# EAGLE design gpi-filter3 (EAGLE 7.1.0)
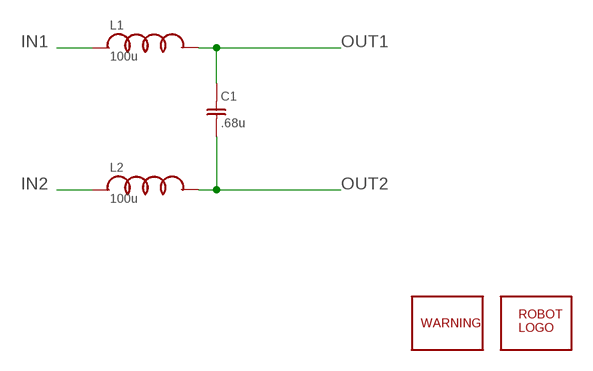
[diagram p0: schematic, sheet 1]

## Parts
C1  .68u  CR46KI36804P1M  [R46KI36804P1M]
L1  100u  LAIRD03  [AIRD03]
L2  100u  LAIRD03  [AIRD03]
U$1  ROBOTMAN-LOGO  [ROBOTMAN-LOGO]
U$2  SYMBOL-WARNING  [SYMBOL-WARNING]

## Nets
IN1: L1.P$1
IN2: L2.P$1
OUT1: C1.P$1 L1.P$2
OUT2: C1.P$2 L2.P$2

## Library data of the parts
C1 = jaw:C
L1 L2 = jaw:L
U$1 = jaw:ROBOTMAN-LOGO
U$2 = jaw:SYMBOL-WARNING

## Board
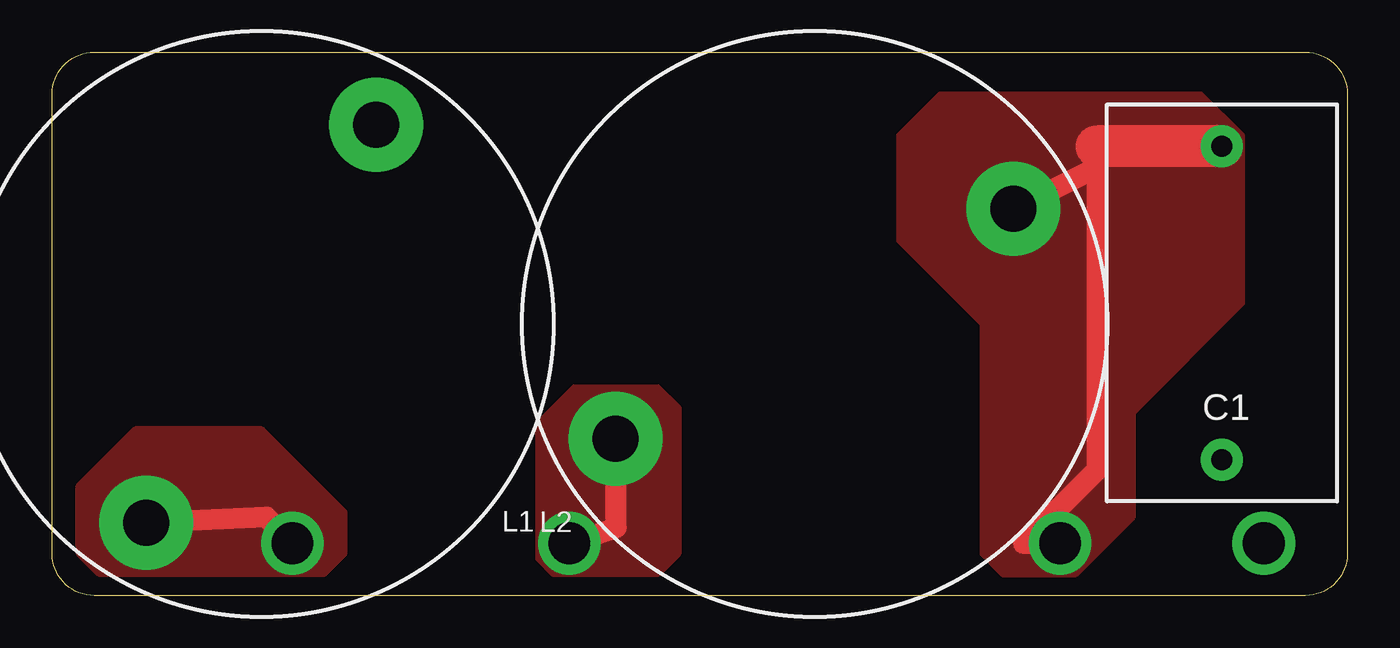
[diagram p1: board, top side]
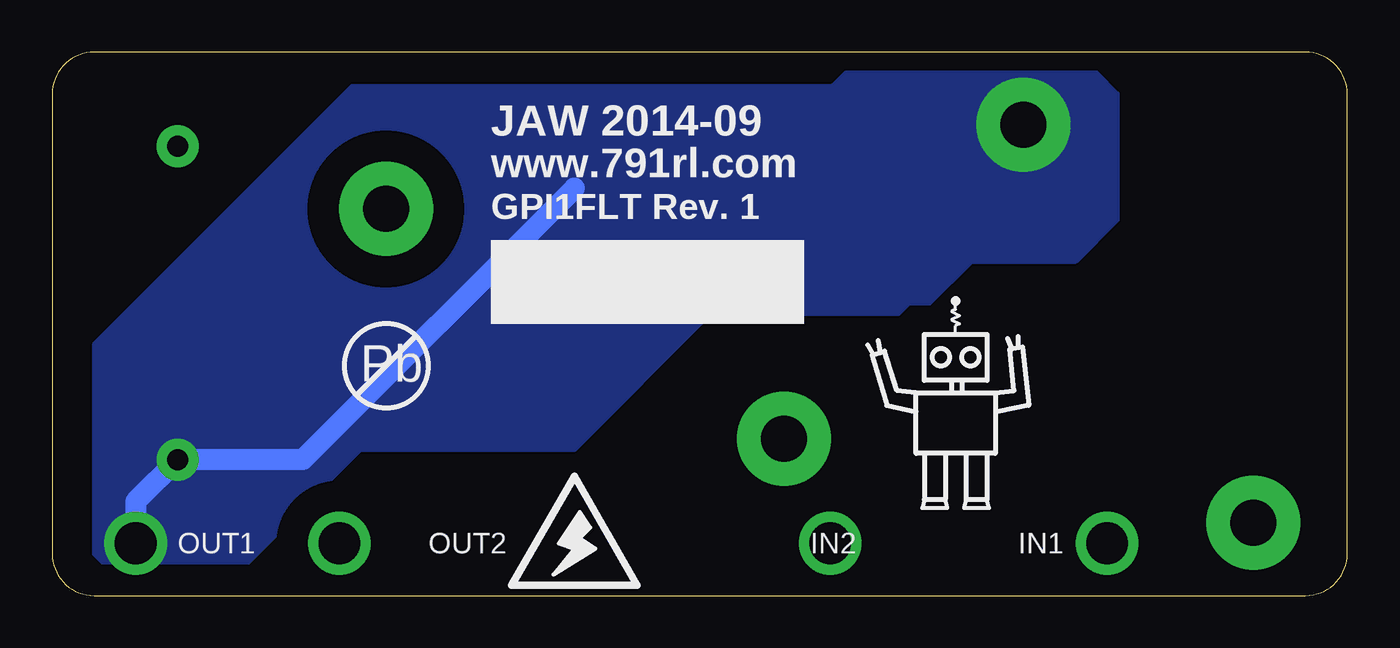
[diagram p2: board, bottom side, seen from below]

Size 62 x 26 mm. Coordinates in mm from the lower left corner, seen from the top.
Outline: 62,24 62,2 arc-90 60,0 2,0 arc-90 0,2 0,24 arc-90 2,26 60,26 arc-90 62,24
Copper layers (1*16): Top 0.0356mm / dielectric 1.5011mm / Bottom 0.0356mm
Design rules "LaenPCBOrder *": minimum track width 6mil, minimum drill 13mil, track to track 6mil, track to pad 6mil, pad to pad 6mil, via to via 6mil, smd to smd 6mil, copper to edge 15mil, drill to drill 6mil, minimum pad ring 7mil, minimum via ring 7mil, stop-mask expansion 4mil, vias tented up to drill 1.5mm, thermal gap 10mil

### Footprints (pad centres in the part's own frame; a part is rotated, then mirrored left to right if it is on the bottom)
R46KI36804P1M = drill 1 pad 2: P$1 -7.5,0; P$2 7.5,0
AIRD03 = drill 2.2 pad 4.5: P$1 -11,0; P$2 11,0

### Placement (x,y rotation side)
C1  56,14 90 top
L1  10,13 60 top
L2  36.5,13 30 top
U$1  18.75,8.5 0 bottom
U$2  37,2.5 0 bottom

### Tracks (layer width: path | path; a pad name or v marks a point on that pad's centre or on a via)
IN1  (via drill 2)
  Top 1: v11.5,2.5 10.25,3.75 L1.P$1
  pour Top (no thermals): 14,4 14,2 13,1 2.25,1 1.25,2 1.25,5.25 4,8 10,8
IN2  (via drill 2)
  Top 1: v24.75,2.5 27,3.25 L2.P$1
  pour Top (no thermals): 30,9 30,2 29,1 24,1 23.25,1.75 23.25,8.25 25,10 29,10
OUT1  (via drill 2 pad 3)
  Bottom 1: 37,19.5 50,6.5 C1.P$1 58,4.5 v58,2.5
  pour Bottom (no thermals): 11,18 11,24 12,25 24,25 25,24 25,14 20,14 18,16 13,16
  pour Bottom (isolate 1.5, no thermals): 18.5,25 47,25 60,12 60,2 59,1 53.25,1 47.25,7 37,7 30.5,13.5 21.5,13.5 19,16
OUT2  (via drill 2 pad 3)
  Top 1: L2.P$2 50,20.5 | 50,20.5 50,21.5 50,20.5 | 50,20.5 50,6 46.5,2.5 v48.25,2.5
  Top 2: C1.P$2 50,21.5
  pour Top (no thermals): 40.5,17 44.5,13 44.5,2 45.5,1 49,1 51.75,3.75 51.75,8.75 57,14 57,22 55,24 42.5,24 40.5,22

### Text on the board
bPlace: JAW 2014-09 | www.791rl.com | GPI1FLT Rev. 1 | Pb | IN2 | OUT1 | IN1 | OUT2